# Altium project mach chan nuoi.PrjPCB
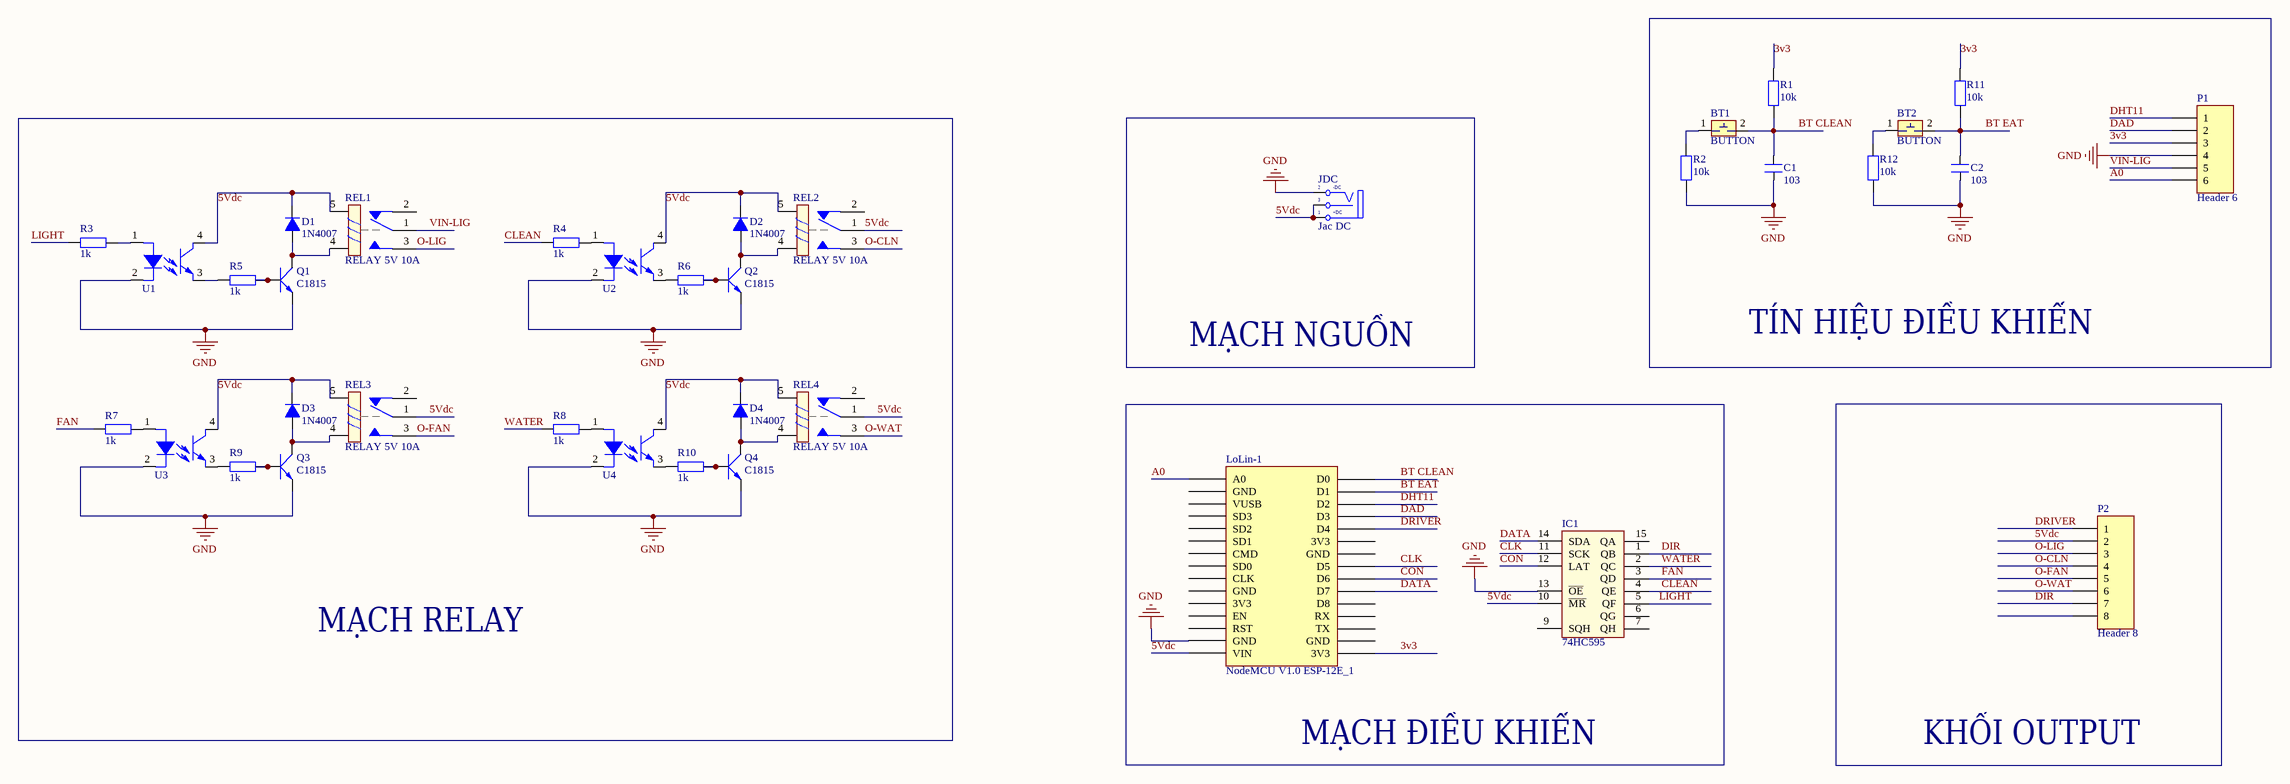
[diagram p0: sdnl.SchDoc]
1 sheet, 37 parts. Net scope: global (net labels, ports and power ports of the same name join across sheets).
Board file: mach nuoi trong.PcbDoc

## Sheet sdnl.SchDoc
size A0

### Parts
BT1  BUTTON  [button 4 pin]
BT2  BUTTON  [button 4 pin]
C1  103  [CN1.5]
C2  103  [CN1.5]
D1  1N4007  [D1A]
D2  1N4007  [D1A]
D3  1N4007  [D1A]
D4  1N4007  [D1A]
IC1  74HC595  [DIP16/W0.3]
JDC  Jac DC  [DC-IN]
LoLin-1  NodeMCU V1.0 ESP-12E_1  [LoLin NodeMcu V3]
P1  Header 6  [HDR1X6]
P2  Header 8  [HDR1X8]
Q1  C1815  [QTO-92]
Q2  C1815  [QTO-92]
Q3  C1815  [QTO-92]
Q4  C1815  [QTO-92]
R1  10k  [R1/4W]
R2  10k  [R1/4W]
R3  1k  [R1/4W]
R4  1k  [R1/4W]
R5  1k  [R1/4W]
R6  1k  [R1/4W]
R7  1k  [R1/4W]
R8  1k  [R1/4W]
R9  1k  [R1/4W]
R10  1k  [R1/4W]
R11  10k  [R1/4W]
R12  10k  [R1/4W]
REL1  RELAY 5V 10A  [RELAY 5V-10A]
REL2  RELAY 5V 10A  [RELAY 5V-10A]
REL3  RELAY 5V 10A  [RELAY 5V-10A]
REL4  RELAY 5V 10A  [RELAY 5V-10A]
U1  PC817  [DIP4]  (value not drawn)
U2  PC817  [DIP4]  (value not drawn)
U3  PC817  [DIP4]  (value not drawn)
U4  PC817  [DIP4]  (value not drawn)

### Nets
GND: C1.1 C2.1 IC1.8(GND) IC1.13(~{OE}) JDC.2(TN) LoLin-1.GND P1.4 Q1.1(E) Q2.1(E) Q3.1(E) Q4.1(E) R2.1 R12.1 U1.2 U2.2 U3.2 U4.2
VCC: IC1.16(VCC)
3v3: LoLin-1.3V3 P1.3 R1.2 R11.2
5Vdc: D1.2(K) D2.2(K) D3.2(K) D4.2(K) IC1.10(~{MR}) JDC.1(T) JDC.3(S) LoLin-1.VIN P2.2 REL1.5 REL2.1 REL2.5 REL3.1 REL3.5 REL4.1 REL4.5 U1.4 U2.4 U3.4 U4.4
A0: LoLin-1.A0 P1.6
BT CLEAN: BT1.2 C1.2 LoLin-1.D0 R1.1
BT EAT: BT2.2 C2.2 LoLin-1.D1 R11.1
CLEAN: IC1.4(QE) R4.1
CLK: IC1.11(SCK) LoLin-1.D5
CON: IC1.12(LAT) LoLin-1.D6
DAD: LoLin-1.D3 P1.2
DATA: IC1.14(SDA) LoLin-1.D7
DHT11: LoLin-1.D2 P1.1
DIR: IC1.1(QB) P2.7
DRIVER: LoLin-1.D4 P2.1
FAN: IC1.3(QD) R7.1
LIGHT: IC1.5(QF) R3.1
O-CLN: P2.4 REL2.3
O-FAN: P2.5 REL3.3
O-LIG: P2.3 REL1.3
O-WAT: P2.6 REL4.3
VIN-LIG: P1.5 REL1.1
WATER: IC1.2(QC) R8.1
NetBT1_1: BT1.1 R2.2
NetBT2_1: BT2.1 R12.2
NetD1_1: D1.1(A) Q1.2(C) REL1.4
NetD2_1: D2.1(A) Q2.2(C) REL2.4
NetD3_1: D3.1(A) Q3.2(C) REL3.4
NetD4_1: D4.1(A) Q4.2(C) REL4.4
NetQ1_3: Q1.3(B) R5.2
NetQ2_3: Q2.3(B) R6.2
NetQ3_3: Q3.3(B) R9.2
NetQ4_3: Q4.3(B) R10.2
NetR3_2: R3.2 U1.1
NetR4_2: R4.2 U2.1
NetR5_1: R5.1 U1.3
NetR6_1: R6.1 U2.3
NetR7_2: R7.2 U3.1
NetR8_2: R8.2 U4.1
NetR9_1: R9.1 U3.3
NetR10_1: R10.1 U4.3

Not connected (* = marked no-connect by the designer): IC1 6(QG) 7(QH) 9(SQH) 15(QA); LoLin-1 CLK CMD D8 EN RST RX SD0 SD1 SD2 SD3 TX VUSB; P2 8; REL1 2; REL2 2; REL3 2; REL4 2

### Notes on the sheet
- MẠCH NGUỒN
- TÍN HIỆU ĐIỀU KHIỂN
- MẠCH RELAY
- MẠCH ĐIỀU KHIỂN
- KHỐI OUTPUT
- (in symbol DCIN) -DC; +DC

### Library data of the parts
BT1 BT2 = BUTTON 4 PIN
C1 C2 = CN1.5: Cap np 682pF => 104pF; Value: 0.01uF
D1-D4 = D1A: Diode 1A; Value: 1N4007
IC1 = 74595: 8 Bit Serial input - Parallel Output; Value: 74HC595
JDC = DCIN: Jac DC input; Value: Jac DC
LoLin-1 = NodeMCU V1.0 ESP-12E_1: LoLin NodeMCU V3
P1 = Header 6: Header, 6-Pin; LatestRevisionDate: 17-Jul-2002; LatestRevisionNote: Re-released for DXP Platform.; Publisher: Altium Limited
Q1-Q4 = C1815_1: NPN 600mW, ECB; Value: C1815
R1-R12 = R1/4W: Resistor 1/4W; Value: R1/4W - 1K
U1-U4 = PC817: Opto Couple; Vendor: Digikey; Fc: 80Khz; Published: 13-April-2009; Publisher: Hoang Nguyen; ComponentLink1Description: Digikey Part Link; ComponentLink2Description: Open Datasheet; ComponentLink2URL: H:\LIBRARY\LIBRARY.Datasheet\ds_PC817.pdf
P2 = Header 8: LatestRevisionDate: 17-Jul-2002; LatestRevisionNote: Re-released for DXP Platform.; Publisher: Altium Limited